# EasyEDA schematic SCH_H-brug.json
TITLE: H-brug; REV: 1.0; Date: 2022-10-14; Sheet: 1/1; Company: HoGent
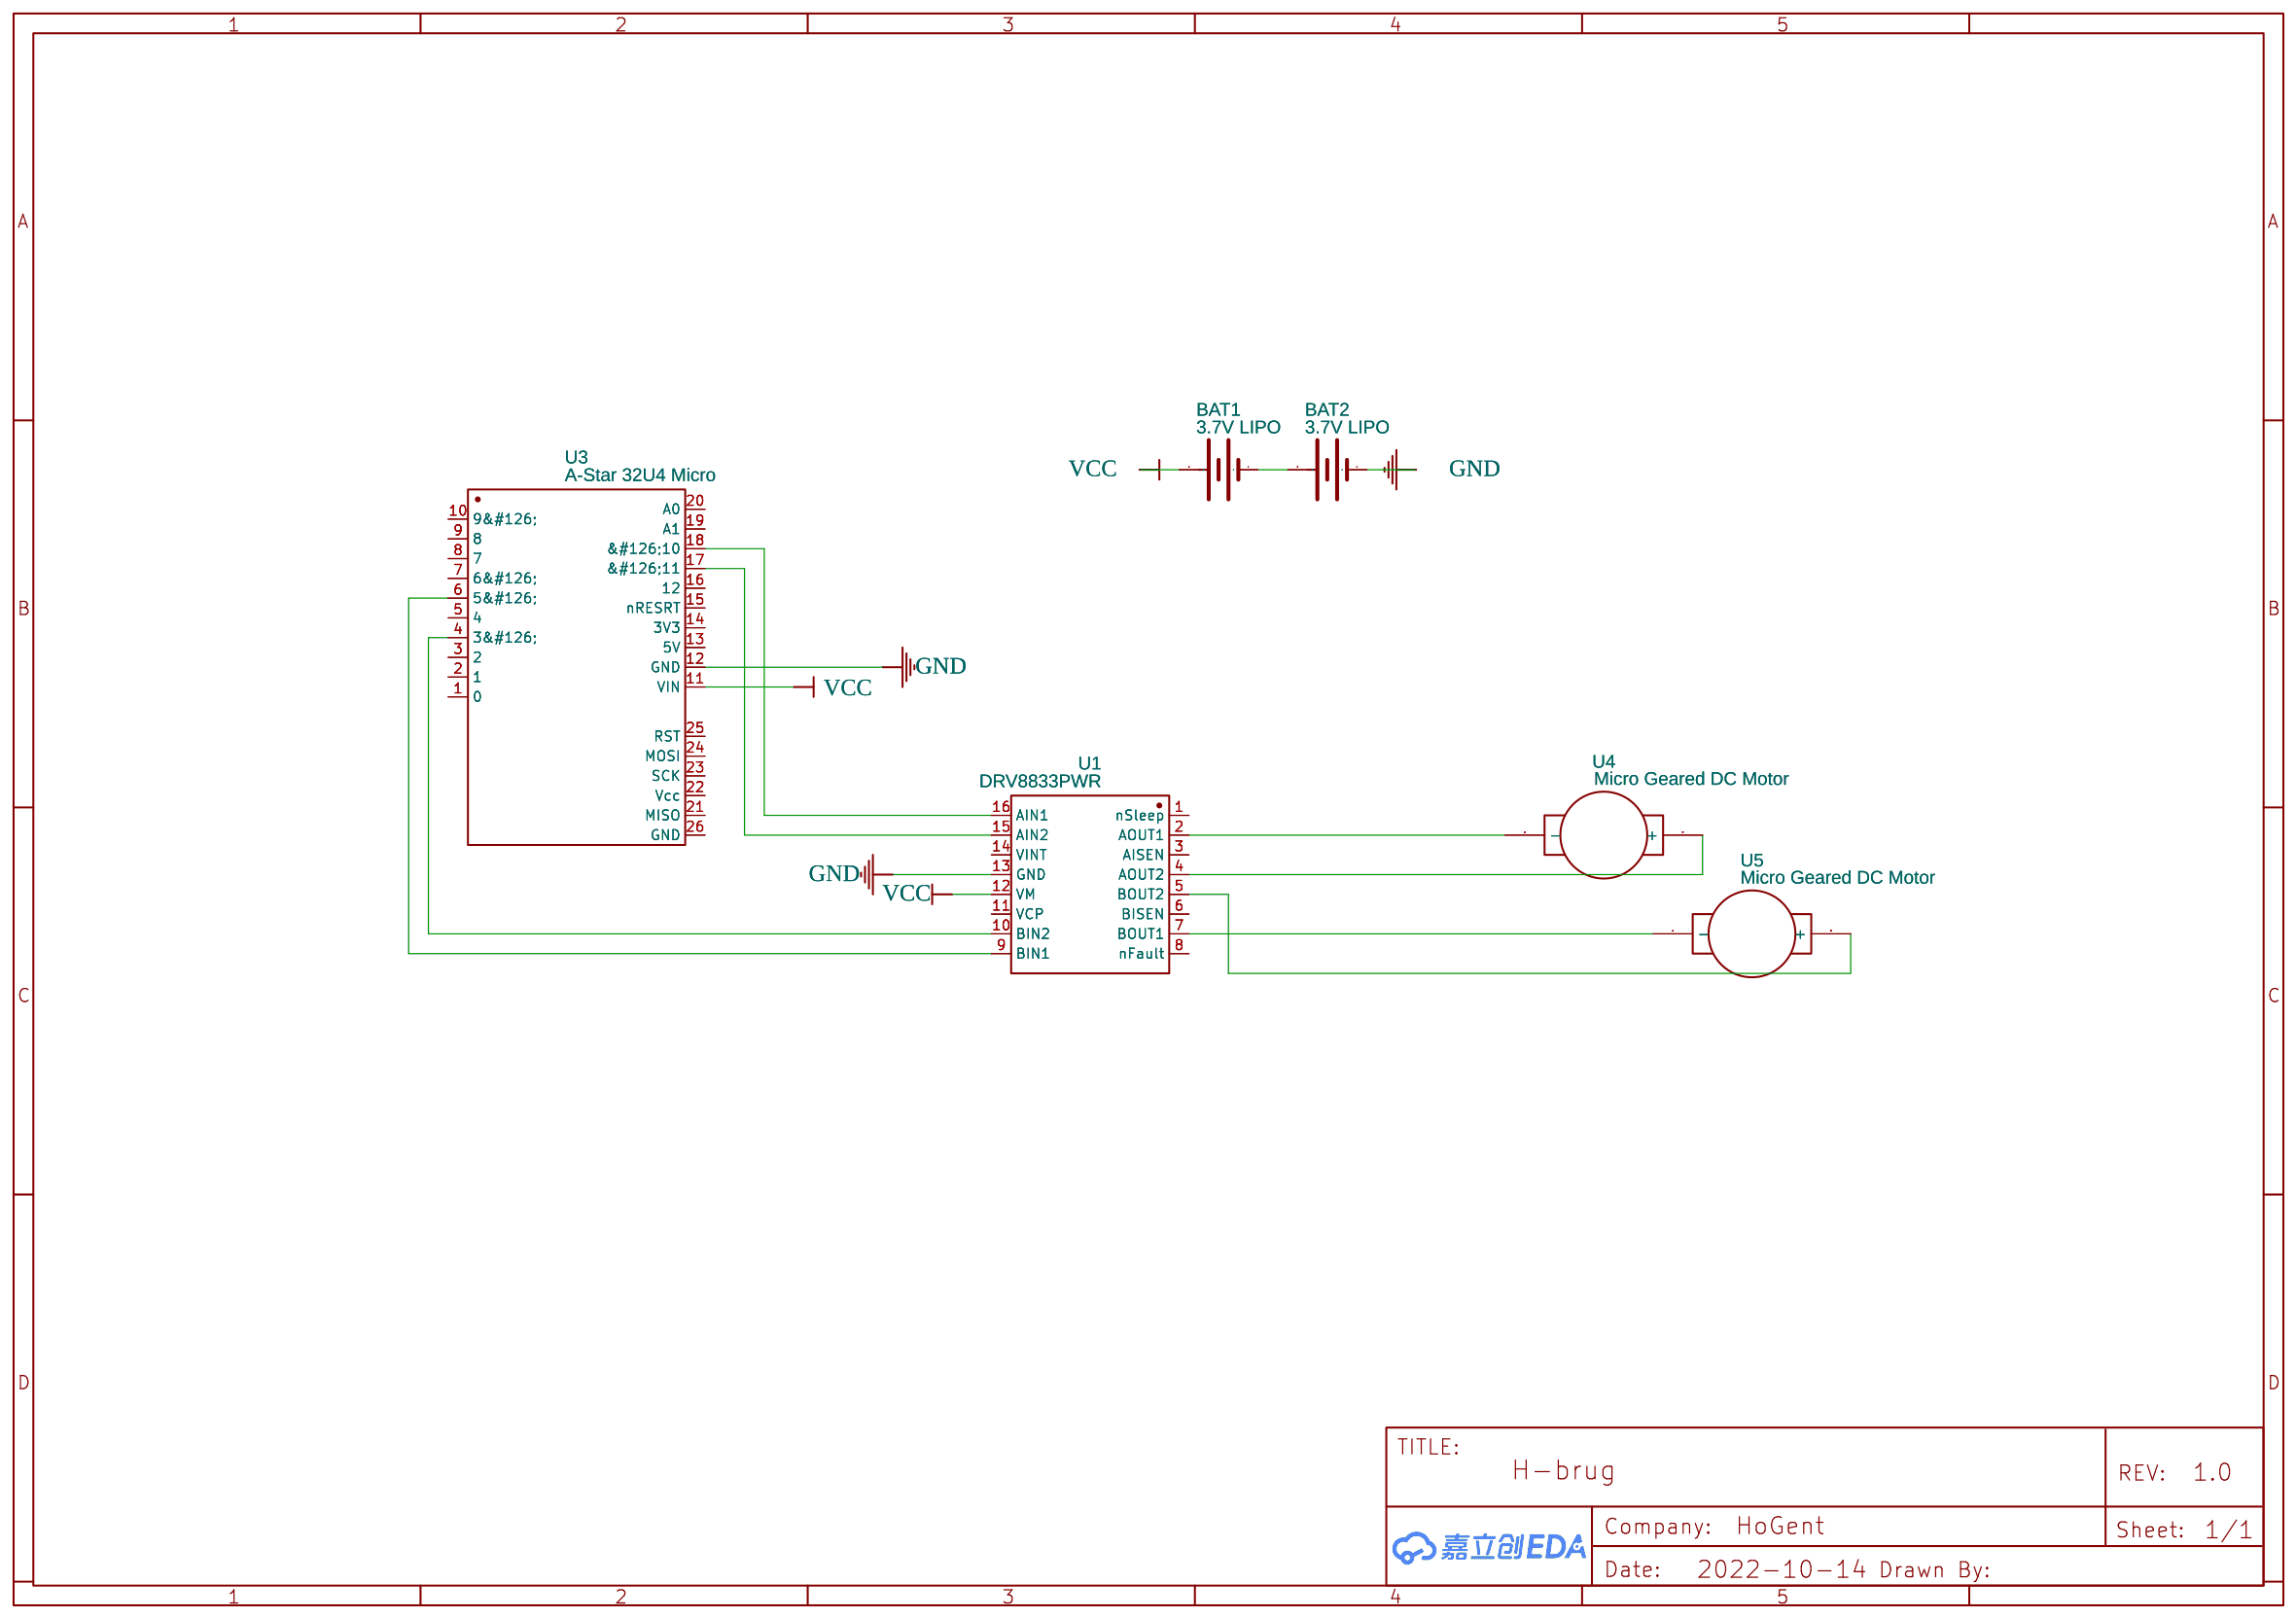
[diagram p0: schematic sheet]

## Parts
BAT1  3.7V LIPO  [LIPO-110-TABS]
BAT2  3.7V LIPO  [LIPO-110-TABS]
U1  DRV8833PWR  [TSSOP-16_L5.0-W4.4-P0.65-LS6.4-BL]
U3  A-Star 32U4 Micro  [A-STAR 32U4 MICRO]
U4  Micro Geared DC Motor  [MICRO GEARED DC MOTOR PADS]
U5  Micro Geared DC Motor  [MICRO GEARED DC MOTOR PADS]

## Library data of the parts
BAT1 BAT2 = 3.7V LIPO: Lipo Battery Pack; Contributor: MoVitro
U1 = DRV8833PWR: Supplier: LCSC; Supplier Part: C544801; Manufacturer: TI(德州仪器); Contributor: LCSC
U3 = A-Star 32U4 Micro: Manufacturer: pololu; Manufacturer Part: 3101; Supplier: Pololu; link: https://www.4project.co.il/documents/doc_3710_3255.pdf; Contributor: Roi_Doitch
U4 U5 = Micro Geared DC Motor: link: https://www.amazon.com/dp/B07N7PY71F?psc=1&ref=ppx_yo2ov_dt_b_product_details; Contributor: Guest

## Nets
GND: BAT2.- U1.13(GND) U3.12(GND)
VCC: BAT1.+ U1.12(VM) U3.11(VIN)
Net-(BAT1--): BAT1.- BAT2.+
Net-(U1-2): U1.2(AOUT1) U4.1(-)
Net-(U1-4): U1.4(AOUT2) U4.2(+)
Net-(U1-5): U1.5(BOUT2) U5.2(+)
Net-(U1-7): U1.7(BOUT1) U5.1(-)
Net-(U1-9): U1.9(BIN1) U3.6(5&#126;)
Net-(U1-10): U1.10(BIN2) U3.4(3&#126;)
Net-(U1-15): U1.15(AIN2) U3.17(&#126;11)
Net-(U1-16): U1.16(AIN1) U3.18(&#126;10)

Not connected (* = marked no-connect by the designer): U1 1(nSleep) 3(AISEN) 6(BISEN) 8(nFault) 11(VCP) 14(VINT); U3 1(0) 2(1) 3(2) 5(4) 7(6&#126;) 8(7) 9(8) 10(9&#126;) 13(5V) 14(3V3) 15(nRESRT) 16(12) 19(A1) 20(A0) 21(MISO) 22(Vcc) 23(SCK) 24(MOSI) 25(RST) 26(GND)
